# EAGLE design dekodery (EAGLE 6.5.0)
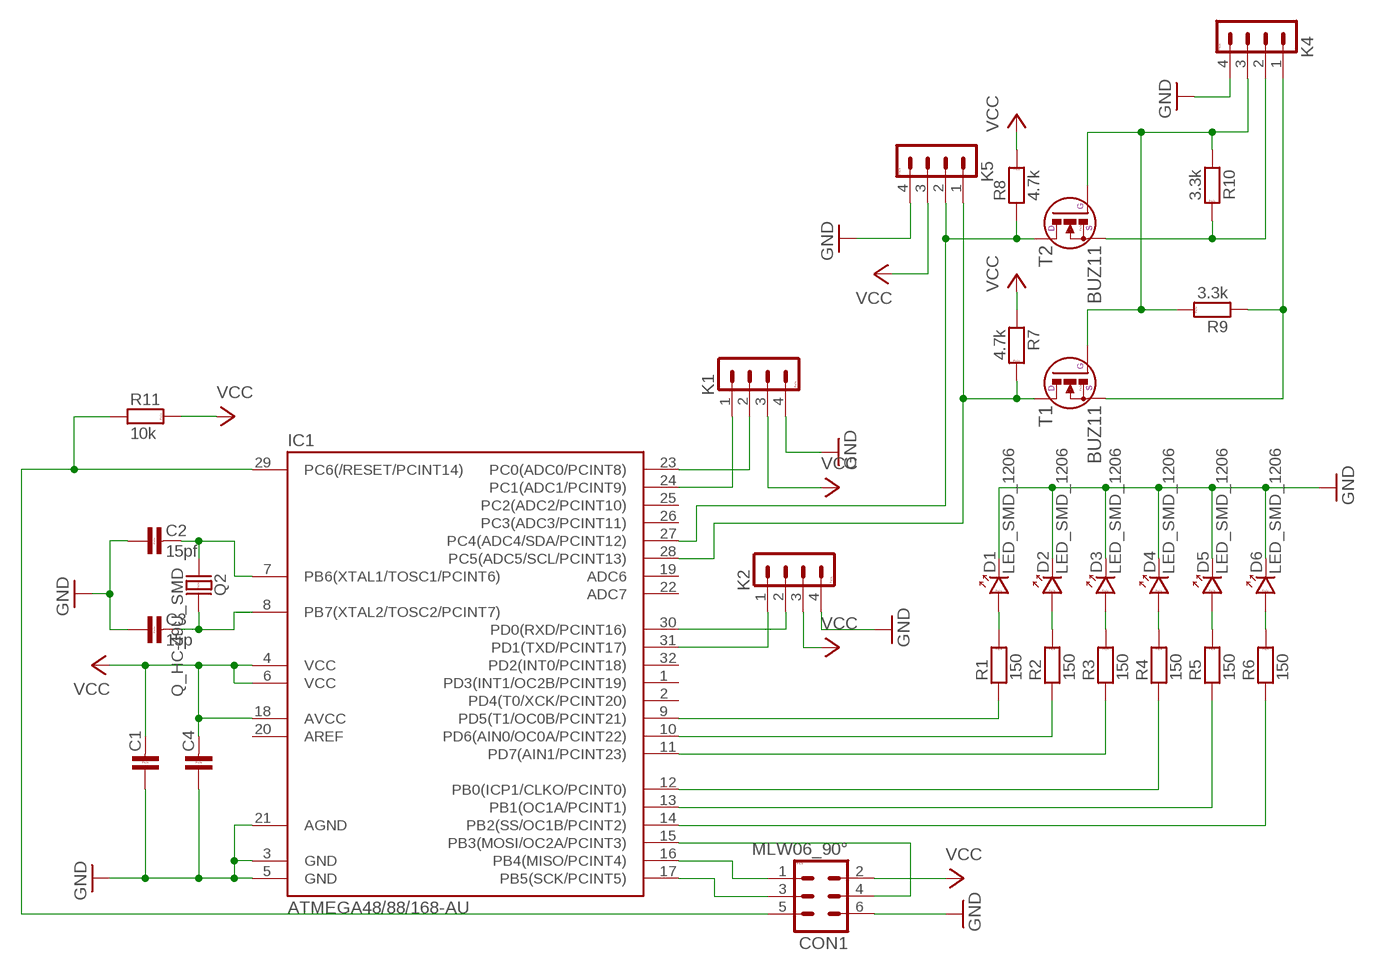
[diagram p0: schematic, sheet 1]

## Parts
C1  C-KERAMIK_SMD_1206  [1206]
C2  15pf  C-KERAMIK_SMD_1206  [1206]
C3  15p  C-KERAMIK_SMD_1206  [1206]
C4  C-KERAMIK_SMD_1206  [1206]
CON1  MLW06_90°  [MLW06A]
D1  LED_SMD_1206  [P1206]
D2  LED_SMD_1206  [P1206]
D3  LED_SMD_1206  [P1206]
D4  LED_SMD_1206  [P1206]
D5  LED_SMD_1206  [P1206]
D6  LED_SMD_1206  [P1206]
IC1  ATMEGA48/88/168-AU  [TQFP32-08]
K1  PSH02-04W  [PSH02-04W]
K2  PSH02-04W  [PSH02-04W]
K4  PSH02-04W  [PSH02-04W]
K5  PSH02-04W  [PSH02-04W]
Q2  Q_HC-49U_SMD  [HC-49US]
R1  150  R_SMD_1206  [1206]
R2  150  R_SMD_1206  [1206]
R3  150  R_SMD_1206  [1206]
R4  150  R_SMD_1206  [1206]
R5  150  R_SMD_1206  [1206]
R6  150  R_SMD_1206  [1206]
R7  4.7k  R_SMD_1206  [1206]
R8  4.7k  R_SMD_1206  [1206]
R9  3.3k  R_SMD_1206  [1206]
R10  3.3k  R_SMD_1206  [1206]
R11  10k  R_SMD_1206  [1206]
T1  BUZ11  [SOT23]
T2  BUZ11  [SOT23]

## Nets
GND: C1.1 C2.1 C3.1 C4.1 CON1.6 D1.K D2.K D3.K D4.K D5.K D6.K IC1.3(GND) IC1.5(GND) IC1.21(AGND) K1.4 K2.4 K4.4 K5.4
N$1: IC1.30(PD0(RXD/PCINT16)) K2.2
N$2: IC1.31(PD1(TXD/PCINT17)) K2.1
N$3: IC1.23(PC0(ADC0/PCINT8)) K1.2
N$4: IC1.24(PC1(ADC1/PCINT9)) K1.1
N$5: IC1.28(PC5(ADC5/SCL/PCINT13)) K5.1 R7.2 T1.3(D)
N$6: C3.2 IC1.8(PB7(XTAL2/TOSC2/PCINT7)) Q2.2
N$7: CON1.1 IC1.16(PB4(MISO/PCINT4))
N$8: CON1.3 IC1.17(PB5(SCK/PCINT5))
N$9: CON1.4 IC1.15(PB3(MOSI/OC2A/PCINT3))
N$10: IC1.9(PD5(T1/OC0B/PCINT21)) R1.1
N$11: IC1.10(PD6(AIN0/OC0A/PCINT22)) R2.1
N$12: IC1.11(PD7(AIN1/PCINT23)) R3.1
N$13: IC1.12(PB0(ICP1/CLKO/PCINT0)) R4.1
N$14: IC1.13(PB1(OC1A/PCINT1)) R5.1
N$15: IC1.14(PB2(SS/OC1B/PCINT2)) R6.1
N$16: D1.A R1.2
N$17: D6.A R6.2
N$18: D5.A R5.2
N$19: D4.A R4.2
N$20: D3.A R3.2
N$21: D2.A R2.2
N$22: C2.2 IC1.7(PB6(XTAL1/TOSC1/PCINT6)) Q2.1
N$23: IC1.27(PC4(ADC4/SDA/PCINT12)) K5.2 R8.1 T2.3(D)
N$24: K4.3 R9.2 R10.1 T1.1(G) T2.1(G)
N$26: K4.2 R10.2 T2.2(S)
N$27: K4.1 R9.1 T1.2(S)
RST: CON1.5 IC1.29(PC6(/RESET/PCINT14)) R11.1
VCC: C1.2 C4.2 CON1.2 IC1.4(VCC) IC1.6(VCC) IC1.18(AVCC) K1.3 K2.3 K5.3 R7.1 R8.2 R11.2
Unconnected: IC1.1(PD3(INT1/OC2B/PCINT19)) IC1.2(PD4(T0/XCK/PCINT20)) IC1.19(ADC6) IC1.20(AREF) IC1.22(ADC7) IC1.25(PC2(ADC2/PCINT10)) IC1.26(PC3(ADC3/PCINT11)) IC1.32(PD2(INT0/PCINT18))

## Library data of the parts
C1-C4 = #PaJa_30:C-KERAMIK: Kondenzator - keramicky
CON1 = #PaJa_konektory:MLW06: Konektory MLW - vidlice - 6x
D1-D6 = #PaJa_30:LED: LED - jednobarevna
IC1 = atmega8:ATMEGA48/88/168
K1 K2 K4 K5 = #PaJa_konektory:PSH02-04: Konektory se zamkem - vidlice - 4pin
Q2 = #PaJa_30:Q_HC-49U: Krystal - 1MHz - 48MHz
R1-R11 = #PaJa_30:R: Rezistor
T1 T2 = ondrap:BUZ11: N-Channel Enhancement MOSFET

## Board
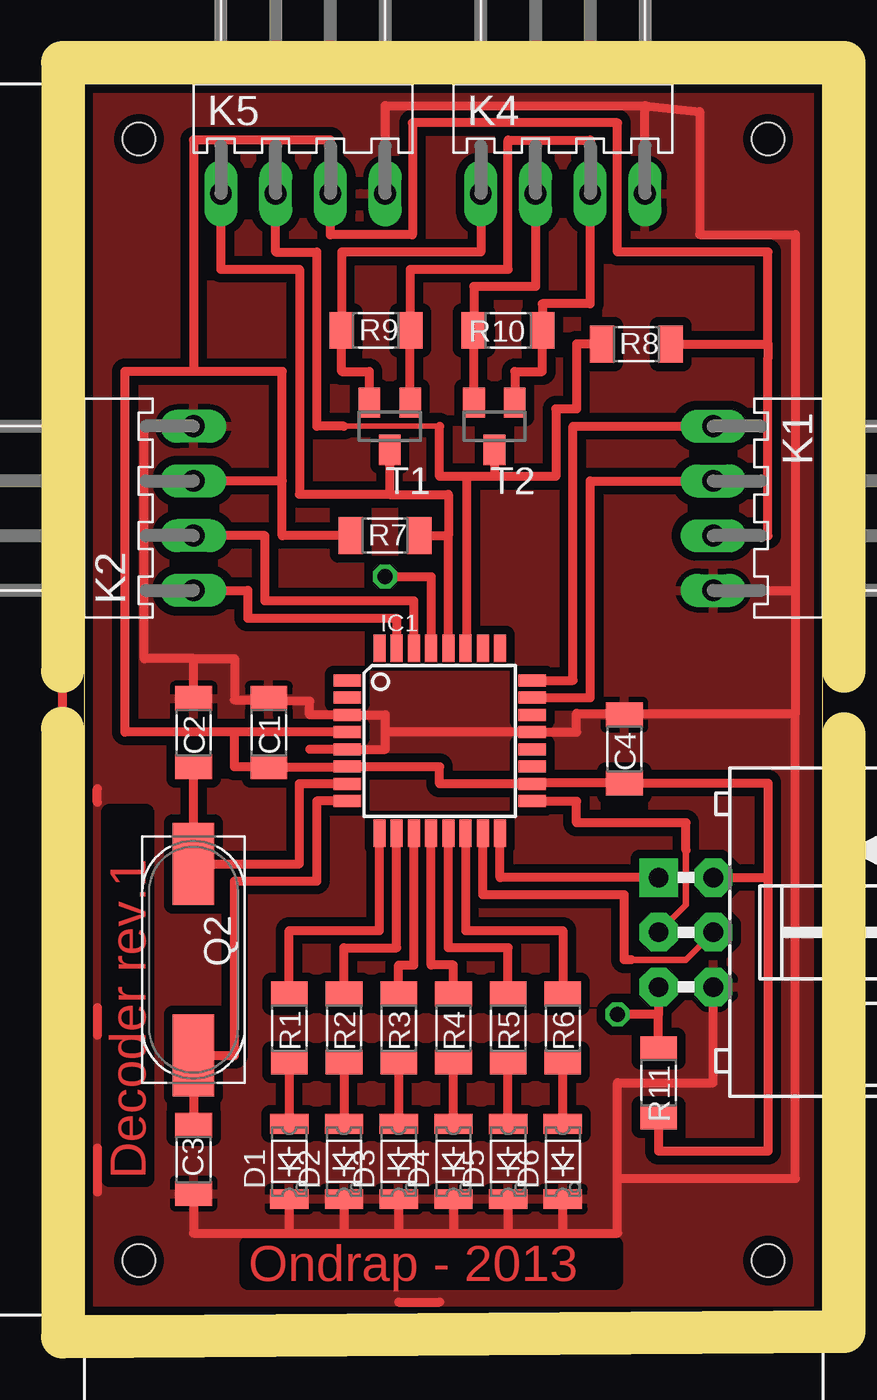
[diagram p1: board, top side]
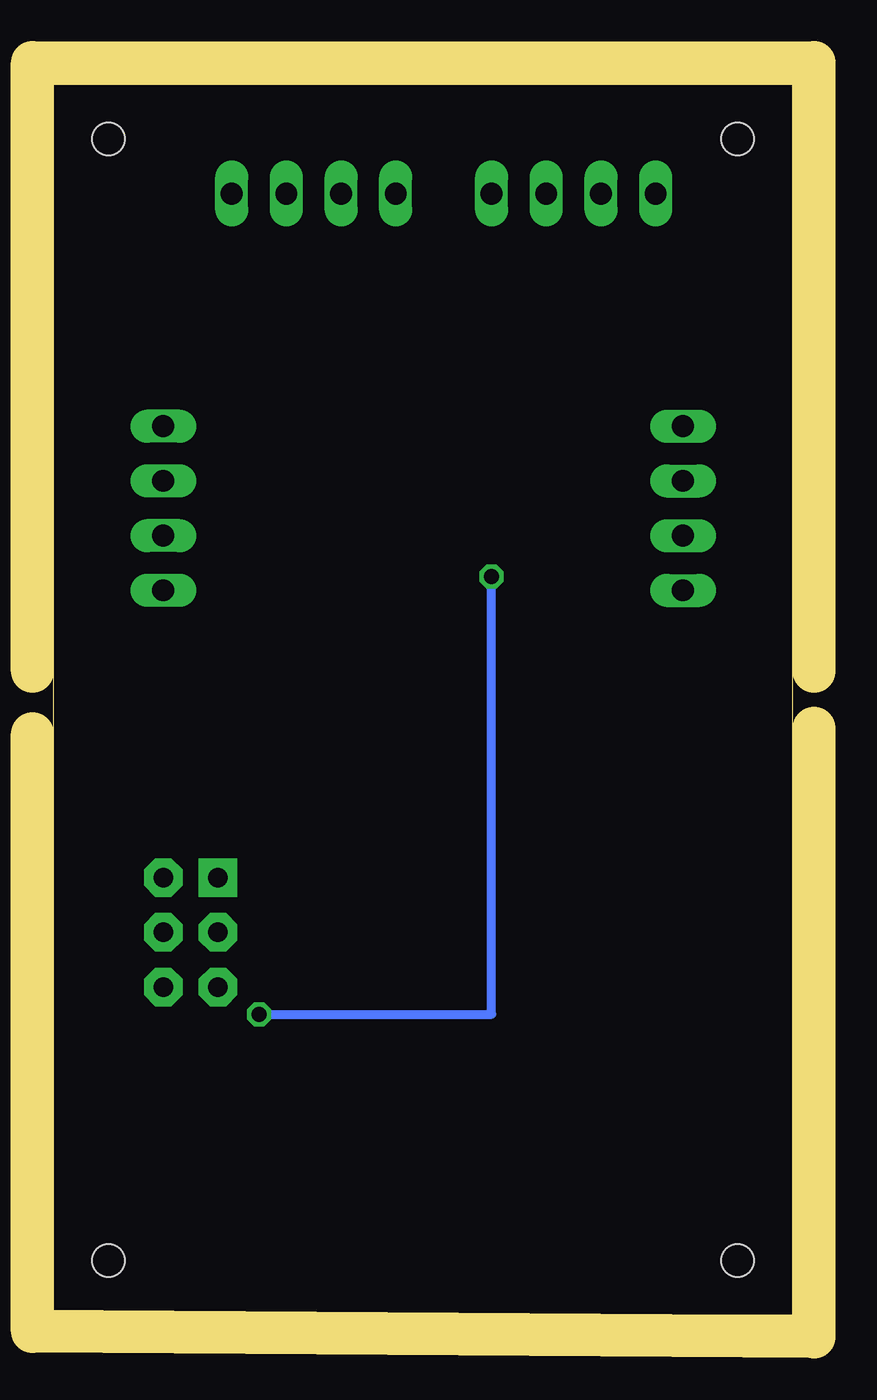
[diagram p2: board, bottom side, seen from below]

Size 34.29 x 57.15 mm. Coordinates in mm from the lower left corner, seen from the top.
Outline: 0,0 34.29,0 34.29,57.15 0,57.15 0,0
Copper layers (1*16): Top 0.035mm / dielectric 1.5mm / Bottom 0.035mm
Design rules "default *": minimum track width 10mil, minimum drill 24mil, track to track 8mil, track to pad 8mil, pad to pad 8mil, via to via 8mil, smd to smd 8mil, copper to edge 0.012mm, drill to drill 8mil, minimum pad ring 10mil, minimum via ring 8mil, stop-mask expansion 4mil, vias tented up to drill 0mil, thermal gap 10mil
Holes 1.5 mm at 2.54,54.61 31.75,54.61 31.75,2.54 2.54,2.54
Milling: 6 lines

### Footprints (pad centres in the part's own frame; a part is rotated, then mirrored left to right if it is on the bottom)
1206 = smd 1.143 x 1.702: 1 -1.587,0; 2 1.587,0
MLW06A = drill 0.914 pad 1.778 square: 1 -2.54,-1.27 | drill 0.914 pad 1.778 octagon: 2 -2.54,1.27; 3 0,-1.27; 4 0,1.27; 5 2.54,-1.27; 6 2.54,1.27
P1206 = smd 0.914 x 1.778: A -1.905,0; K 1.587,0
TQFP32-08 = smd 1.27 x 0.559: 1 -4.293,2.8; 2 -4.293,2; 3 -4.293,1.2; 4 -4.293,0.4; 5 -4.293,-0.4; 6 -4.293,-1.2; 7 -4.293,-2; 8 -4.293,-2.8; 17 4.293,-2.8; 18 4.293,-2; 19 4.293,-1.2; 20 4.293,-0.4; 21 4.293,0.4; 22 4.293,1.2; 23 4.293,2; 24 4.293,2.8 | smd 0.559 x 1.27: 9 -2.8,-4.293; 10 -2,-4.293; 11 -1.2,-4.293; 12 -0.4,-4.293; 13 0.4,-4.293; 14 1.2,-4.293; 15 2,-4.293; 16 2.8,-4.293; 25 2.8,4.293; 26 2,4.293; 27 1.2,4.293; 28 0.4,4.293; 29 -0.4,4.293; 30 -1.2,4.293; 31 -2,4.293; 32 -2.8,4.293
PSH02-04W = drill 1.016 pad 1.422 long: 1 -3.81,0; 2 -1.27,0; 3 1.27,0; 4 3.81,0
HC-49US = smd 3.81 x 1.93: 1 -4.445,0; 2 4.445,0
SOT23 = smd 1 x 1.4: 1 -0.95,-1.1; 2 0.95,-1.1; 3 0,1.1

### Placement (x,y rotation side)
C1  8.57,27.05 270 top
C2  5.08,27.05 270 top
C3  5.08,7.24 90 top
C4  25.08,26.29 270 top
CON1  27.94,17.78 270 top
D1  9.53,6.99 270 top
D2  12.07,6.99 270 top
D3  14.61,6.99 270 top
D4  17.14,6.99 270 top
D5  19.68,6.99 270 top
D6  22.22,6.99 270 top
IC1  16.51,26.67 0 top
K1  29.21,37.46 270 top
K2  5.08,37.46 90 top
K4  22.22,52.07 0 top
K5  10.16,52.07 0 top
Q2  5.08,16.51 270 top
R1  9.53,13.33 270 top
R2  12.07,13.33 270 top
R3  14.61,13.33 270 top
R4  17.14,13.33 270 top
R5  19.68,13.33 270 top
R6  22.22,13.33 270 top
R7  13.97,36.2 0 top
R8  25.64,45.09 0 top
R9  13.55,45.72 0 top
R10  19.68,45.72 180 top
R11  26.67,10.79 270 top
T1  14.19,41.27 180 top
T2  19.05,41.27 180 top

### Tracks (layer width: path | path; a pad name or v marks a point on that pad's centre or on a via)
GND
  Top 0.406: D1.K 9.53,3.81 | 9.53,3.81 12.07,3.81 | 12.07,3.81 14.61,3.81 | 14.61,3.81 17.14,3.81 | 17.14,3.81 19.68,3.81 | 19.68,3.81 22.22,3.81 | 22.22,3.81 D6.K | D5.K 19.68,3.81 | D4.K 17.14,3.81 | D3.K 14.61,3.81 | D2.K 12.07,3.81 | 6.98,28.57 10.48,28.5 10.48,27.87 IC1.3 13.97,27.87 13.97,27.07 | 6.98,28.57 8.25,28.57 C1.1 | IC1.5 13.97,26.27 13.97,27.07 | C3.1 5.08,3.81 9.53,3.81 | C2.1 5.08,30.48 | 5.08,30.48 6.98,30.48 6.98,28.57 | 5.08,30.48 2.79,30.48 2.79,41.27 K2.4 | 13.97,27.07 IC1.21 22.86,27.07 22.86,27.94 25.4,27.94 | 22.22,3.81 24.77,3.81 24.77,6.35 | 24.77,6.35 24.77,10.79 29.21,10.79 CON1.6 | 25.4,27.94 C4.1 | 25.4,27.94 33.02,27.94 | K5.4 13.97,56.16 26.04,56.16 | K1.4 33.02,33.66 | 33.02,33.66 33.02,27.94 | K4.4 26.04,56.16 | 26.04,56.16 28.57,55.88 28.57,50.16 33.02,50.16 33.02,33.66 | 24.77,6.35 33.02,6.35 33.02,27.94 | 0.61,7.76 0.61,5.71 | 14.61,0.61 16.51,0.61 | 0.61,14.29 0.61,13.02 | 0.61,23.81 0.61,24.45
  pour Top (isolate 0.406): 0,57.15 0,0 34.29,0 34.29,57.15
N$1
  Top 0.406: IC1.30 15.31,33.16 8.4,33.16 8.4,36.2 K2.2
N$2
  Top 0.406: K2.1 7.6,33.66 7.6,32.36 14.51,32.36 IC1.31
N$3
  Top 0.406: IC1.23 23.5,28.67 23.5,38.73 K1.2
N$4
  Top 0.406: IC1.24 22.7,29.47 22.7,41.27 K1.1
N$5
  Top 0.406: R7.2 16.91,36.2 | IC1.28 16.91,36.2 | 14.19,38.1 16.91,38.1 16.91,36.2 | T1.3 14.19,38.1 | 14.19,38.1 10,38.1 10,48.56 6.35,48.56 K5.1
N$6
  Top 0.406: IC1.8 10.8,23.87 10.8,20.16 6.98,20.16 6.98,12.06 Q2.2 C3.2
N$7
  Top 0.406: CON1.1 19.31,20.32 IC1.16
N$8
  Top 0.305: CON1.3 27.94,19.05 27.94,21.59
  Top 0.406: 27.94,21.59 27.94,22.86 22.86,22.86 22.86,23.87 IC1.17
N$9
  Top 0.305: CON1.4 27.94,16.51 25.4,16.51
  Top 0.406: 25.4,16.51 25.08,16.51 25.08,19.52 18.51,19.52 IC1.15
N$10
  Top 0.406: R1.1 9.53,17.86 13.71,17.86 IC1.9
N$11
  Top 0.406: R2.1 12.07,17.06 14.51,17.06 IC1.10
N$12
  Top 0.406: R3.1 14.61,16.26 15.31,16.26 IC1.11
N$13
  Top 0.406: R4.1 17.14,16.26 16.11,16.26 IC1.12
N$14
  Top 0.406: R5.1 19.68,17.06 16.91,17.06 IC1.13
N$15
  Top 0.406: IC1.14 17.71,17.86 22.22,17.86 R6.1
N$16
  Top 0.406: R1.2 | R1.2 D1.A
N$17
  Top 0.406: D6.A | D6.A R6.2
N$18
  Top 0.406: D5.A | D5.A R5.2
N$19
  Top 0.406: D4.A | D4.A R4.2
N$20
  Top 0.406: R3.2 | R3.2 D3.A
N$21
  Top 0.406: R2.2 | R2.2 D2.A
N$22
  Top 0.406: IC1.7 10,24.67 10,20.95 Q2.1 C2.2
N$23
  Top 0.254: 16.51,41.27 12.07,41.27
  Top 0.406: IC1.27 17.78,30.96 17.78,38.94 | R8.1 22.86,45.09 22.86,42.07 21.9,42.07 21.9,38.94 19.05,38.94 | T2.3 19.05,38.94 | 19.05,38.94 17.78,38.94 | 17.78,38.94 16.51,38.94 16.51,41.27 | 12.07,41.27 10.8,41.27 10.8,49.36 8.89,49.36 K5.2
N$24
  Top 0.254: T2.1 19.68,42.38
  Top 0.406: T2.1 20,43.81 21.27,43.81 R10.1 21.27,46.96 23.5,46.96 K4.3 23.5,54.56 19.68,54.56 19.68,48.56 15.14,48.56 R9.2 | R9.2 15.24,45.72 | 15.24,42.38 T1.1 | T1.1 | T1.1 R9.2
N$25
  Top 0.406: 12.38,26.27 10.48,26.27
N$26
  Top 0.406: T2.2 R10.2 18.1,47.76 20.96,47.76 K4.2
N$27
  Top 0.406: R9.1 12.07,45.72 | T1.2 13.23,43.81 11.96,43.81 R9.1 | R9.1 11.96,49.36 18.41,49.36 K4.1
N$28
  Top 0.406: -1,-1 -1,58.15
RST  (via drill 0.7)
  Top 0.406: R11.1 26.67,13.97 | CON1.5 26.67,13.97 | 26.67,13.97 v24.77,13.97 | v13.97,34.29 16.11,34.29 IC1.29
  Bottom 0.406: v24.77,13.97 13.97,13.97 v13.97,34.29
VCC
  Top 0.406: R7.1 9.2,36.2 9.2,38.73 | 9.2,38.73 K2.3 | R11.2 26.67,7.62 31.75,7.62 31.75,20.32 | CON1.2 31.75,20.32 | 31.75,20.32 31.75,24.7 C4.2 20.8,24.7 IC1.18 16.51,24.67 16.51,25.47 IC1.6 C1.2 6.98,25.46 6.98,27.07 | IC1.4 6.98,27.07 | 6.98,27.07 1.91,27.07 1.91,43.81 5.08,43.81 | 9.2,38.73 9.2,43.81 5.08,43.81 | K1.3 31.75,36.2 31.75,44.45 31.75,45.09 | 31.75,45.09 31.75,49.36 24.77,49.36 24.77,55.36 15.24,55.36 15.24,50.16 11.43,50.16 K5.3 11.43,54.56 5.08,54.56 5.08,43.81 | R8.2 31.75,45.09

### Text on the board
Top: Decoder rev.1 | Ondrap - 2013